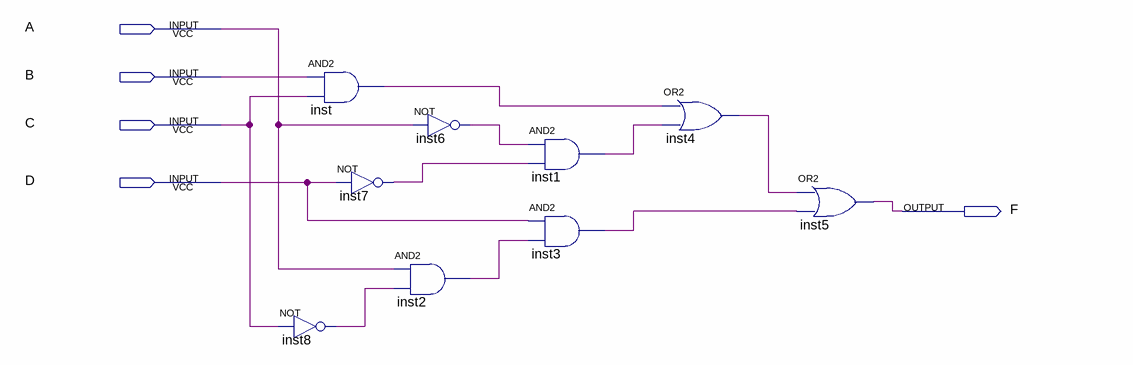
[diagram p0: schematic sheet]
// Quartus schematic part2.bdf as structural Verilog: 9 symbols, 5 pins
module part2 (
  input  A,
  input  B,
  input  C,
  input  D,
  output F
);

  wire inst1_out, inst2_out, inst3_out, inst4_out, inst6_out, inst7_out, inst8_out, inst_out;

  and inst (inst_out, B, C);
  not inst7 (inst7_out, D);
  not inst8 (inst8_out, C);
  not inst6 (inst6_out, A);
  and inst2 (inst2_out, A, inst8_out);
  and inst1 (inst1_out, inst6_out, inst7_out);
  and inst3 (inst3_out, D, inst2_out);
  or inst4 (inst4_out, inst_out, inst1_out);
  or inst5 (F, inst4_out, inst3_out);
endmodule
